# EAGLE schematic Raincenter RS232 Converter (EAGLE 6.6.0)
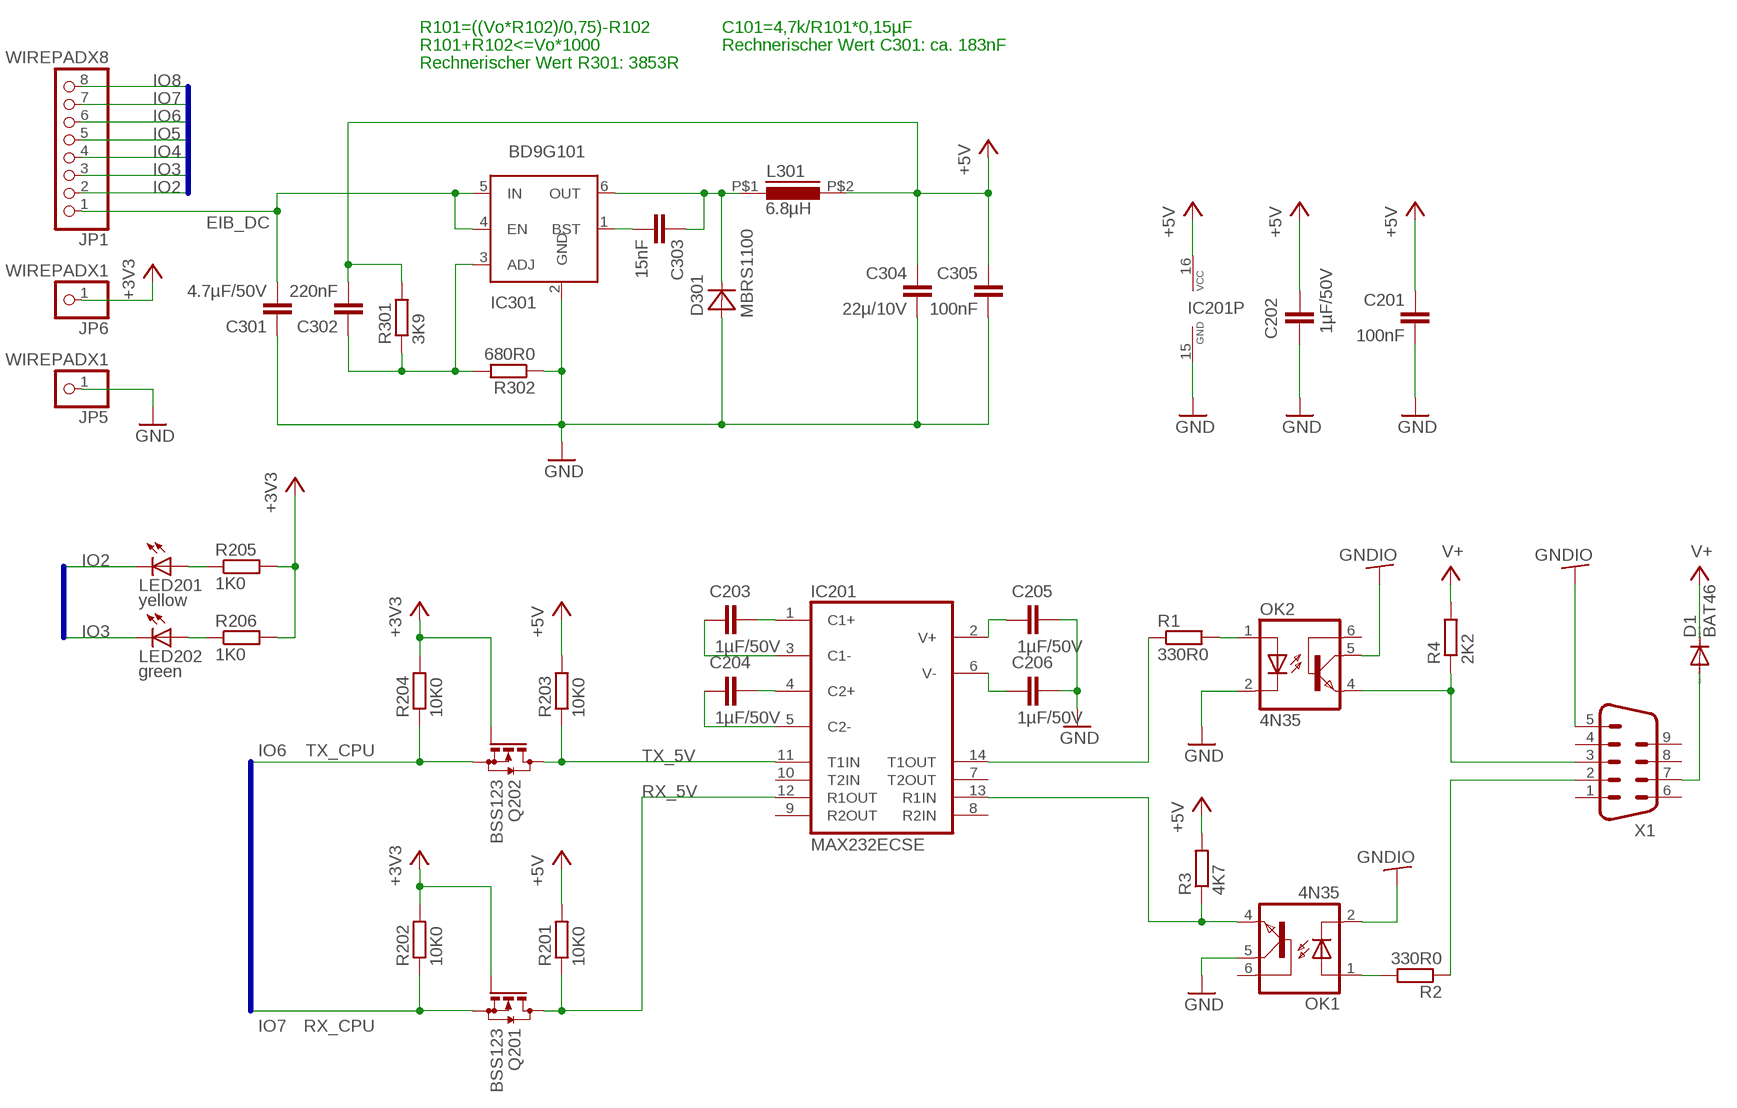
[diagram p0: schematic, sheet 1]

## Parts
C201  100nF  C-EUC1206  [C1206]
C202  1µF/50V  C-EUC1206  [C1206]
C203  1µF/50V  C-EUC1206  [C1206]
C204  1µF/50V  C-EUC1206  [C1206]
C205  1µF/50V  C-EUC1206  [C1206]
C206  1µF/50V  C-EUC1206  [C1206]
C301  4.7µF/50V  C-EUC1206  [C1206]
C302  220nF  C-EUC1206  [C1206]
C303  15nF  C-EUC1206  [C1206]
C304  22µ/10V  C-EUC1206  [C1206]
C305  100nF  C-EUC1206  [C1206]
D1  BAT46  1N4148DO35-7  [DO35-7]
D301  MBRS1100  MBRA340T3  [SMA]
IC201  MAX232ECSE  MAX3232CSE  [SO16]
IC301  BD9G101  BD9G101GBD9G101G-SOT23-6  [SOT23-6]
JP1  WIREPADX8  [SMD1,27X2,54X8]
JP5  WIREPADX1  [SMD1,27X2,54]
JP6  WIREPADX1  [SMD1,27X2,54]
L301  6.8µH  IND_FASTRON_1616FPS  [PIS2812]
LED201  yellow  LEDCHIPLED_1206  [CHIPLED_1206]
LED202  green  LEDCHIPLED_1206  [CHIPLED_1206]
OK1  4N35  [DIL06]
OK2  4N35  [DIL06]
Q201  BSS123  [SOT23]
Q202  BSS123  [SOT23]
R1  330R0  R-EU_R1206  [R1206]
R2  330R0  R-EU_R1206  [R1206]
R3  4K7  R-EU_R1206  [R1206]
R4  2K2  R-EU_R1206  [R1206]
R201  10K0  R-EU_R1206  [R1206]
R202  10K0  R-EU_R1206  [R1206]
R203  10K0  R-EU_R1206  [R1206]
R204  10K0  R-EU_R1206  [R1206]
R205  1K0  R-EU_R1206  [R1206]
R206  1K0  R-EU_R1206  [R1206]
R301  3K9  R-EU_R1206  [R1206]
R302  680R0  R-EU_R1206  [R1206]
X1  M09HP  [M09HP]

## Nets
+3V3: JP6.1 Q201.1(G) Q202.1(G) R202.2 R204.2 R205.2 R206.2
+5V: C201.1 C202.1 C302.2 C304.1 C305.1 IC201.16(VCC) L301.P$2 R3.2 R201.2 R203.2 R301.2
EIB_DC: C301.2 IC301.4(EN) IC301.5(IN) JP1.1
GND: C201.2 C202.2 C205.1 C206.1 C301.1 C304.2 C305.2 D301.A IC201.15(GND) IC301.2(GND) JP5.1 OK1.5(COL) OK2.2(C) R302.1
GNDIO: OK1.2(C) OK2.5(COL) X1.5
IO2: JP1.2 LED201.C
IO3: JP1.3 LED202.C
IO4: JP1.4
IO5: JP1.5
IO6: JP1.6 Q202.2(S) R204.1
IO7: JP1.7 Q201.2(S) R202.1
IO8: JP1.8
LX1: C303.1 D301.C IC301.6(OUT) L301.P$1
N$1: C303.2 IC301.1(BST)
N$2: OK2.4(EMI) R4.1 X1.3
N$3: C302.1 IC301.3(ADJ) R301.1 R302.2
N$4: R2.1 X1.2
N$5: LED201.A R205.1
N$6: IC201.14(T1OUT) R1.1
N$7: D1.A X1.7
N$8: OK1.1(A) R2.2
N$9: IC201.13(R1IN) OK1.4(EMI) R3.1
N$10: OK2.1(A) R1.2
N$11: LED202.A R206.1
N$20: C203.1 IC201.1(C1+)
N$21: C203.2 IC201.3(C1-)
N$22: C205.2 IC201.2(V+)
N$23: C206.2 IC201.6(V-)
N$24: C204.1 IC201.4(C2+)
N$25: C204.2 IC201.5(C2-)
RX_5V: IC201.12(R1OUT) Q201.3(D) R201.1
TX_5V: IC201.11(T1IN) Q202.3(D) R203.1
V+: D1.C R4.2
Unconnected: IC201.7(T2OUT) IC201.8(R2IN) IC201.9(R2OUT) IC201.10(T2IN) OK1.6(BAS) OK2.6(BAS) X1.1 X1.4 X1.6 X1.8 X1.9

## Buses
IO[2..8]

## Notes on the sheet
- R101=((Vo*R102)/0,75)-R102 | C101=4,7k/R101*0,15µF
- R101+R102<=Vo*1000 | Rechnerischer Wert C301: ca. 183nF
- Rechnerischer Wert R301: 3853R
- TX_CPU
- RX_CPU

## Library data of the parts
C201 C305 = rcl:C-EU: CAPACITOR, European symbol; REICHELT: X7R-G1206 100N
C202-C206 = rcl:C-EU: CAPACITOR, European symbol; REICHELT: KEM X7R1206 1,0U
C301 = rcl:C-EU: CAPACITOR, European symbol; REICHELT: X7R-G1206 4,7/50
C302 = rcl:C-EU: CAPACITOR, European symbol; REICHELT: KEM X7R1206 220N
C303 = rcl:C-EU: CAPACITOR, European symbol; REICHELT: X7R-G1206 15N
C304 = rcl:C-EU: CAPACITOR, European symbol; REICHELT: X7R-G1206 22/10
D1 = diode:1N4148: DIODE high speed (Philips)
D301 = diode:MBRA340T3: Surface Mount Schottky Power Rectifier Source: http://www.onsemi.com/pub_link/Collateral/MBRA340T3-D.PDF; REICHELT: MBRS 1100 SMD
IC201 = maxim:MAX3232*: True RS-232 Transceivers 3.0V to 5.5V, Low-Power up to 1Mbps, Using Four 0.1µF External Capacitors Source: http://pdfserv.maxim-ic.com/en/ds/MAX3222-MAX3241.pdf; MPN: MAX3232CSE; OC_FARNELL: 9725490; OC_NEWARK: 90C2890; REICHELT: MAX 232 ECSE
IC301 = Stefan_selfbus:BD9G101G; DIGI-KEY: BD9G101G-CT-ND
JP1 = selfbus:WIREPADX8
JP5 JP6 = selfbus:WIREPADX1
L301 = Stefan_selfbus:IND_FASTRON_1616FPS; REICHELT: L-1616FPS 6,8µ
LED201 = led:LED: LED OSRAM: - CHIPLED LG R971, LG N971, LY N971, LG Q971, LY Q971, LO R971, LY R971 LH N974, LH R974 LS Q976, LO Q976, LY Q976 LO Q996 - Hyper CHIPLED LW Q18S LB Q993, LB Q99A, LB R99A - SideLED LS A670, LO A670, LY A670, LG A670, LP A670 LB A673, LV A673, LT A673, LW A673 LH A674 LY A675 LS A676, LA A676, LO A676, LY A676, LW A676 LS A679, LY A679, LG A679 - Hyper Micro SIDELED® LS Y876, LA Y876, LO Y876, LY Y876 LT Y87S - SmartLED LW L88C, LW L88S LB L89C, LB L89S, LG L890 LS L89K, LO L89K, LY L89K LS L896, LA L896, LO L896, LY L896 - TOPLED LS T670, LO T670, LY T670, LG T670, LP T670 LSG T670, LSP T670, LSY T670, LOP T670, LYG T670 LG T671, LOG T671, LSG T671 LB T673, LV T673, LT T673, LW T673 LH T674 LS T676, LA T676, LO T676, LY T676, LB T676, LH T676, LSB T676, LW T676 LB T67C, LV T67C, LT T67C, LS T67K, LO T67K, LY T67K, LW E67C LS E67B, LA E67B, LO E67B, LY E67B, LB E67C, LV E67C, LT E67C LW T67C LS T679, LY T679, LG T679 LS T770, LO T770, LY T770, LG T770, LP T770 LB T773, LV T773, LT T773, LW T773 LH T774 LS E675, LA E675, LY E675, LS T675 LS T776, LA T776, LO T776, LY T776, LB T776 LHGB T686 LT T68C, LB T68C - Hyper Mini TOPLED® LB M676 - Mini TOPLED Santana® LG M470 LS M47K, LO M47K, LY M47K Source: http://www.osram.convergy.de - LUMILED® LXK2-PW12-R00, LXK2-PW12-S00, LXK2-PW14-U00, LXK2-PW14-V00 LXK2-PM12-R00, LXK2-PM12-S00, LXK2-PM14-U00 LXK2-PE12-Q00, LXK2-PE12-R00, LXK2-PE12-S00, LXK2-PE14-T00, LXK2-PE14-U00 LXK2-PB12-K00, LXK2-PB12-L00, LXK2-PB12-M00, LXK2-PB14-N00, LXK2-PB14-P00, LXK2-PB14-Q00 LXK2-PR12-L00, LXK2-PR12-M00, LXK2-PR14-Q00, LXK2-PR14-R00 LXK2-PD12-Q00, LXK2-PD12-R00, LXK2-PD12-S00 LXK2-PH12-R00, LXK2-PH12-S00 LXK2-PL12-P00, LXK2-PL12-Q00, LXK2-PL12-R00 Source: www.luxeon.com; REICHELT: SMD-LED 1206 GE
LED202 = led:LED: LED OSRAM: - CHIPLED LG R971, LG N971, LY N971, LG Q971, LY Q971, LO R971, LY R971 LH N974, LH R974 LS Q976, LO Q976, LY Q976 LO Q996 - Hyper CHIPLED LW Q18S LB Q993, LB Q99A, LB R99A - SideLED LS A670, LO A670, LY A670, LG A670, LP A670 LB A673, LV A673, LT A673, LW A673 LH A674 LY A675 LS A676, LA A676, LO A676, LY A676, LW A676 LS A679, LY A679, LG A679 - Hyper Micro SIDELED® LS Y876, LA Y876, LO Y876, LY Y876 LT Y87S - SmartLED LW L88C, LW L88S LB L89C, LB L89S, LG L890 LS L89K, LO L89K, LY L89K LS L896, LA L896, LO L896, LY L896 - TOPLED LS T670, LO T670, LY T670, LG T670, LP T670 LSG T670, LSP T670, LSY T670, LOP T670, LYG T670 LG T671, LOG T671, LSG T671 LB T673, LV T673, LT T673, LW T673 LH T674 LS T676, LA T676, LO T676, LY T676, LB T676, LH T676, LSB T676, LW T676 LB T67C, LV T67C, LT T67C, LS T67K, LO T67K, LY T67K, LW E67C LS E67B, LA E67B, LO E67B, LY E67B, LB E67C, LV E67C, LT E67C LW T67C LS T679, LY T679, LG T679 LS T770, LO T770, LY T770, LG T770, LP T770 LB T773, LV T773, LT T773, LW T773 LH T774 LS E675, LA E675, LY E675, LS T675 LS T776, LA T776, LO T776, LY T776, LB T776 LHGB T686 LT T68C, LB T68C - Hyper Mini TOPLED® LB M676 - Mini TOPLED Santana® LG M470 LS M47K, LO M47K, LY M47K Source: http://www.osram.convergy.de - LUMILED® LXK2-PW12-R00, LXK2-PW12-S00, LXK2-PW14-U00, LXK2-PW14-V00 LXK2-PM12-R00, LXK2-PM12-S00, LXK2-PM14-U00 LXK2-PE12-Q00, LXK2-PE12-R00, LXK2-PE12-S00, LXK2-PE14-T00, LXK2-PE14-U00 LXK2-PB12-K00, LXK2-PB12-L00, LXK2-PB12-M00, LXK2-PB14-N00, LXK2-PB14-P00, LXK2-PB14-Q00 LXK2-PR12-L00, LXK2-PR12-M00, LXK2-PR14-Q00, LXK2-PR14-R00 LXK2-PD12-Q00, LXK2-PD12-R00, LXK2-PD12-S00 LXK2-PH12-R00, LXK2-PH12-S00 LXK2-PL12-P00, LXK2-PL12-Q00, LXK2-PL12-R00 Source: www.luxeon.com; REICHELT: SMD-LED 1206 GN
OK1 OK2 = optocoupler:4N35: MOTOROLA OPTO COUPLER; MF: FAIRCHILD SEMICONDUCTOR; MPN: 4N35; OC_FARNELL: 1328375; OC_NEWARK: 72K9946
Q201 Q202 = transistor-small-signal:BSS123: N-CHANNEL MOS FET; REICHELT: BSS 138 SMD
R1-R4 R301 = rcl:R-EU_: RESISTOR, European symbol; REICHELT: RND 1206 1 3,9K
R201-R204 = rcl:R-EU_: RESISTOR, European symbol; REICHELT: RND 1206 1 10K
R205 R206 = rcl:R-EU_: RESISTOR, European symbol; REICHELT: RND 1206 1 1,0K
R302 = rcl:R-EU_: RESISTOR, European symbol; REICHELT: SMD 1/4W 680
X1 = con-subd:M09: SUB-D; OC_FARNELL: unknown; OC_NEWARK: unknown